# EAGLE design 1s (EAGLE 9.1.1)
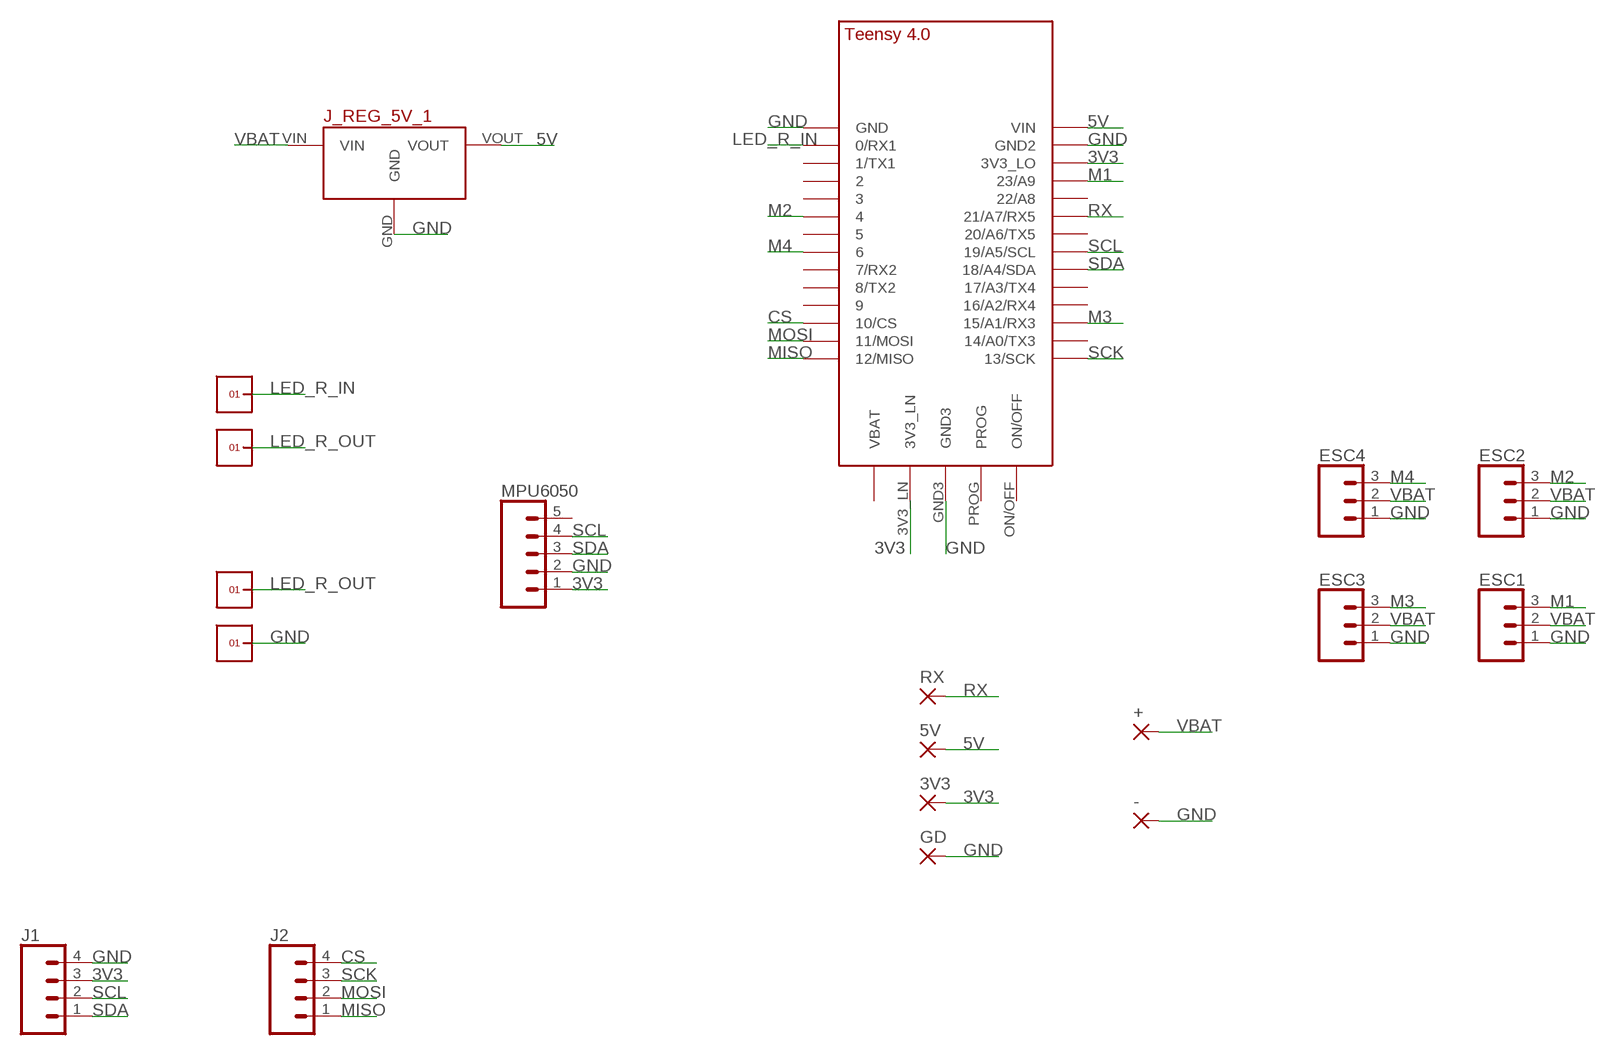
[diagram p0: schematic, sheet 1]

## Parts
3V3  SMD2  [SMD1,27-2,54]
5V  SMD2  [SMD1,27-2,54]
+  SMD5  [SMD2,54-5,08]
-  SMD5  [SMD2,54-5,08]
ESC1  455-1750-1-ND  CONN_03  [1X03]
ESC2  455-1750-1-ND  CONN_03  [1X03]
ESC3  455-1750-1-ND  CONN_03  [1X03]
ESC4  455-1750-1-ND  CONN_03  [1X03]
GD  SMD2  [SMD1,27-2,54]
J1  CONN_041X04_NO_SILK  [1X04_NO_SILK]
J2  CONN_041X04_NO_SILK  [1X04_NO_SILK]
J_REG_5V_1  5V_VOLTAGE_REGULATOR  [5V_VOLTAGE_REGULATOR]
MPU6050  CONN_05NO_SILK  [1X05_NO_SILK]
RX  SMD2  [SMD1,27-2,54]
U$1  TEENSY_4.0  [TEENSY_4.0]
U$3  1X1  [1X1]
U$4  1X1  [1X1]
U$6  1X1  [1X1]
U$7  1X1  [1X1]

## Nets
3V3: 3V3.1(P) J1.3 MPU6050.1 U$1.3V3_LN U$1.3V3_LO
5V: 5V.1(P) J_REG_5V_1.VOUT U$1.VIN
CS: J2.4 U$1.10/CS
GND: -.1(P) ESC1.1 ESC2.1 ESC3.1 ESC4.1 GD.1(P) J1.4 J_REG_5V_1.GND MPU6050.2 U$1.GND U$1.GND2 U$1.GND3 U$7.1
LED_R_IN: U$1.0/RX(0/RX1) U$3.1
LED_R_OUT: U$4.1 U$6.1
M1: ESC1.3 U$1.23/A9
M2: ESC2.3 U$1.4/CANRX
M3: ESC3.3 U$1.15/A1(15/A1/RX3)
M4: ESC4.3 U$1.6
MISO: J2.1 U$1.12/MISO
MOSI: J2.2 U$1.11/MOSI
RX: RX.1(P) U$1.21/A7(21/A7/RX5)
SCK: J2.3 U$1.13/SCK
SCL: J1.2 MPU6050.4 U$1.19/A5/SCL
SDA: J1.1 MPU6050.3 U$1.18/A4/SDA
VBAT: +.1(P) ESC1.2 ESC2.2 ESC3.2 ESC4.2 J_REG_5V_1.VIN
Unconnected: MPU6050.5 U$1.1/TX(1/TX1) U$1.2 U$1.3/CANTX U$1.5 U$1.7(7/RX2) U$1.8(8/TX2) U$1.9/CS U$1.14/A0(14/A0/TX3) U$1.16/A2(16/A2/RX4) U$1.17/A3(17/A3/TX4) U$1.20/A6(20/A6/TX5) U$1.22/A8 U$1.ON/OFF U$1.PROG U$1.VBAT\(VBAT)

## Library data of the parts
3V3 5V GD RX = wirepad:SMD2: SMD PAD
+ - = wirepad:SMD5: SMD PAD
ESC1-ESC4 = SparkFun-Connectors:CONN_03: Multi connection point. Often used as Generic Header-pin footprint for 0.1 inch spaced/style header connections On any of the 0.1 inch spaced packages, you can populate with these: Break Away Headers - Straight <https://www.sparkfun.com/products/116> (PRT-00116) Break Away Male Headers - Right Angle <https://www.sparkfun.com/products/553> (PRT-00553) Female Headers <https://www.sparkfun.com/products/115> (PRT-00115) Break Away Headers - Machine Pin <https://www.sparkfun.com/products/117> (PRT-00117) Break Away Female Headers - Swiss Machine Pin <https://www.sparkfun.com/products/743> (PRT-00743) Stackable Header - 3 Pin (Female, 0.1") <https://www.sparkfun.com/products/13875> (PRT-13875) For SCREWTERMINALS and SPRING TERMINALS visit here: Screw Terimnals on SparkFun.com <https://www.sparkfun.com/search/results?term=Screw+Terminals> (5mm/3.5mm/2.54mm spacing) This device is also useful as a general connection point to wire up your design to another part of your project. Our various solder wires solder well into these plated through hole pads. Hook-Up Wire - Assortment (Stranded, 22 AWG) <https://www.sparkfun.com/products/11375> (PRT-11375) Hook-Up Wire - Assortment (Solid Core, 22 AWG) <https://www.sparkfun.com/products/11367> (PRT-11367) View the entire wire category on our website here <https://www.sparkfun.com/categories/141> Special notes: Molex polarized connector foot print use with SKU : PRT-08232 with associated crimp pins and housings.; PROD_ID: XXX-00000
J1 J2 = SparkFun-Connectors:CONN_04: Multi connection point. Often used as Generic Header-pin footprint for 0.1 inch spaced/style header connections On any of the 0.1 inch spaced packages, you can populate with these: Break Away Headers - Straight <https://www.sparkfun.com/products/116> (PRT-00116) Break Away Male Headers - Right Angle <https://www.sparkfun.com/products/553> (PRT-00553) Female Headers <https://www.sparkfun.com/products/115> (PRT-00115) Break Away Headers - Machine Pin <https://www.sparkfun.com/products/117> (PRT-00117) Break Away Female Headers - Swiss Machine Pin <https://www.sparkfun.com/products/743> (PRT-00743) For SCREWTERMINALS and SPRING TERMINALS visit here: Screw Terimnals on SparkFun.com <https://www.sparkfun.com/search/results?term=Screw+Terminals> (5mm/3.5mm/2.54mm spacing) This device is also useful as a general connection point to wire up your design to another part of your project. Our various solder wires solder well into these plated through hole pads. Hook-Up Wire - Assortment (Stranded, 22 AWG) <https://www.sparkfun.com/products/11375> (PRT-11375) Hook-Up Wire - Assortment (Solid Core, 22 AWG) <https://www.sparkfun.com/products/11367> (PRT-11367) View the entire wire category on our website here <https://www.sparkfun.com/categories/141> Special notes: Molex polarized connector foot print use with SKU : PRT-08231 with associated crimp pins and housings. 1MM SMD Version SKU: PRT-10208; PROD_ID: CONN-09696
J_REG_5V_1 = Pololu Voltage Regulators:5V_VOLTAGE_REGULATOR: Polulu 5V Step-Up/Step-Down Voltage REgulator S7V7F5
MPU6050 = SparkFun-Connectors:CONN_05: Multi connection point. Often used as Generic Header-pin footprint for 0.1 inch spaced/style header connections On any of the 0.1 inch spaced packages, you can populate with these: Break Away Headers - Straight <https://www.sparkfun.com/products/116> (PRT-00116) Break Away Male Headers - Right Angle <https://www.sparkfun.com/products/553> (PRT-00553) Female Headers <https://www.sparkfun.com/products/115> (PRT-00115) Break Away Headers - Machine Pin <https://www.sparkfun.com/products/117> (PRT-00117) Break Away Female Headers - Swiss Machine Pin <https://www.sparkfun.com/products/743> (PRT-00743) For SCREWTERMINALS and SPRING TERMINALS visit here: Screw Terimnals on SparkFun.com <https://www.sparkfun.com/search/results?term=Screw+Terminals> (5mm/3.5mm/2.54mm spacing) This device is also useful as a general connection point to wire up your design to another part of your project. Our various solder wires solder well into these plated through hole pads. Hook-Up Wire - Assortment (Stranded, 22 AWG) <https://www.sparkfun.com/products/11375> (PRT-11375) Hook-Up Wire - Assortment (Solid Core, 22 AWG) <https://www.sparkfun.com/products/11367> (PRT-11367) View the entire wire category on our website here <https://www.sparkfun.com/categories/141> Special notes: Molex polarized connector foot print use with SKU : PRT-08231 with associated crimp pins and housings. 1MM SMD Version SKU: PRT-10208
U$1 = TEENSY 4.0:TEENSY_4.0
U$3 U$4 U$6 U$7 = headers(2mm):1X1

## Board
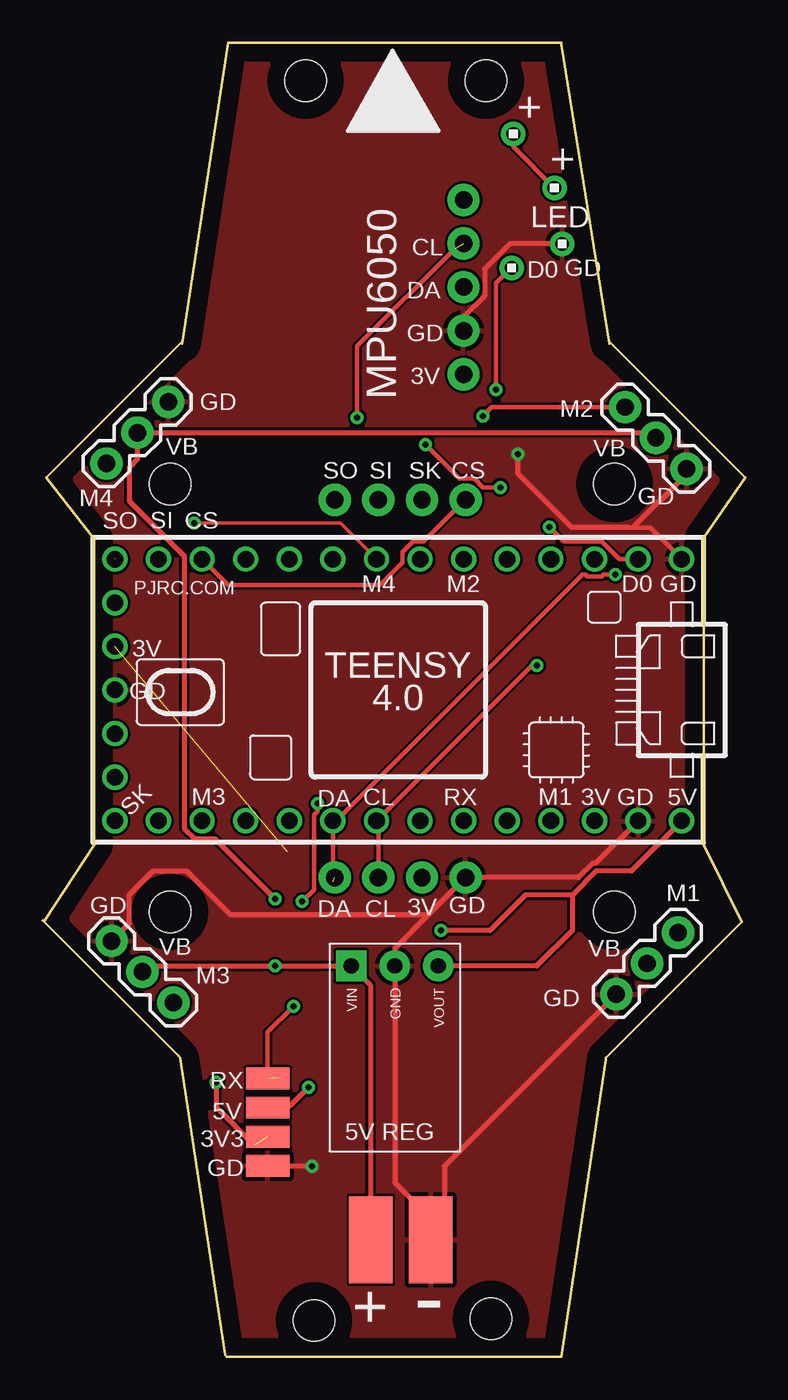
[diagram p1: board, top side]
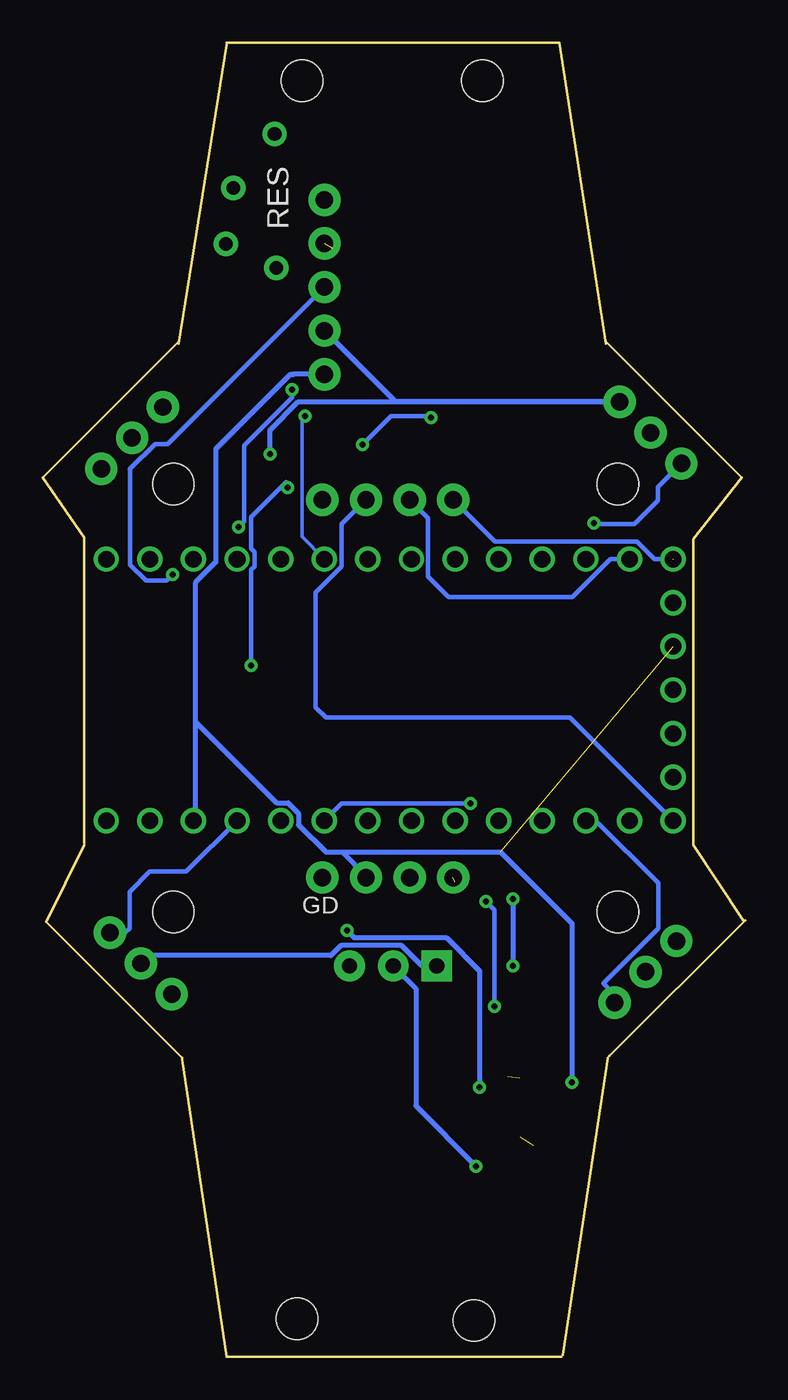
[diagram p2: board, bottom side, seen from below]

Size 40.9 x 76.5 mm. Coordinates in mm from the lower left corner, seen from the top.
Outline: 38.5,47.6 38.5,29.9
Outline: 30.2,76.5 10.8,76.5 8.1,59
Outline: 10.7,0 30.1,0
Outline: 8,17.4 10.6,0.1
Outline: 32.8,17.3 30.2,0
Outline: 32.8,17.4 40.7,25.3 38.5,29.8
Outline: 0.1,25.4 3,29.8 3,47.6 0.2,51.2 8.1,59.1
Outline: 7.9,17.5 0,25.4
Outline: 33,59.1 40.9,51.2 38.5,47.7
Outline: 30.2,76.4 33,59
Copper layers (1*16): Top 0.035mm / dielectric 1.5mm / Bottom 0.035mm
Design rules "default": minimum track width 6mil, minimum drill 0.35mm, track to track 6mil, track to pad 6mil, pad to pad 6mil, via to via 6mil, smd to smd 6mil, copper to edge 40mil, drill to drill 6mil, minimum pad ring 10mil, minimum via ring 8mil, stop-mask expansion 4mil, vias tented up to drill 0mil, thermal gap 10mil
Holes 2.4 mm at 15.3,74.3 25.8,74.3 15.8,2.1 26.1,2.2 33.3,50.8 7.4,50.8 7.4,25.9 33.3,25.9

### Footprints (pad centres in the part's own frame; a part is rotated, then mirrored left to right if it is on the bottom)
SMD1,27-2,54 = smd 1.27 x 2.54: 1 0,0
SMD2,54-5,08 = smd 2.54 x 5.08: 1 0,0
1X03 = drill 1.016 pad 1.88: 1 0,0; 2 2.54,0; 3 5.08,0
1X04_NO_SILK = drill 1.016 pad 1.88: 1 0,0; 2 2.54,0; 3 5.08,0; 4 7.62,0
5V_VOLTAGE_REGULATOR = drill 0.9 pad 1.778: GND 0,-6.35; VOUT -2.54,-6.35 | drill 0.9 pad 1.778 square: VIN 2.54,-6.35
1X05_NO_SILK = drill 1.016 pad 1.88: 1 0,0; 2 2.54,0; 3 5.08,0; 4 7.62,0; 5 10.16,0
TEENSY_4.0 = drill 0.965: 0/RX -13.97,-7.62; 1/TX -11.43,-7.62; 2 -8.89,-7.62; 3/CANTX -6.35,-7.62; 3V3_LN 16.51,-2.54; 3V3_LO -11.43,7.62; 4/CANRX -3.81,-7.62; 5 -1.27,-7.62; 6 1.27,-7.62; 7 3.81,-7.62; 8 6.35,-7.62; 9/CS 8.89,-7.62; 10/CS 11.43,-7.62; 11/MOSI 13.97,-7.62; 12/MISO 16.51,-7.62; 13/SCK 16.51,7.62; 14/A0 13.97,7.62; 15/A1 11.43,7.62; 16/A2 8.89,7.62; 17/A3 6.35,7.62; 18/A4/SDA 3.81,7.62; 19/A5/SCL 1.27,7.62; 20/A6 -1.27,7.62; 21/A7 -3.81,7.62; 22/A8 -6.35,7.62; 23/A9 -8.89,7.62; GND -16.51,-7.62; GND2 -13.97,7.62; GND3 16.51,0; ON/OFF 16.51,5.08; PROG 16.51,2.54; VBAT\ 16.51,-5.08; VIN -16.51,7.62
1X1 = drill 0.8 pad 1.422: 1 0,0

### Placement (x,y rotation side)
3V3  13.1,12.8 90 top
5V  13.1,14.5 90 top
+  19.11,6.8 0 top
-  22.6,6.8 0 top
ESC1  33.4,21.1 45 top
ESC2  37.5,51.7 135 top
ESC3  4,24.2 315 top
ESC4  7.3,55.6 225 top
GD  13.1,11.1 90 top
J1  17,27.9 0 top
J2  17,49.9 0 top
J_REG_5V_1  20.5,16.4 180 top
MPU6050  24.5,57.2 90 top
RX  13.1,16.2 90 top
U$1  20.7,38.82 180 top
U$3  27.3,63.4 0 top
U$4  27.4,71.19 0 top
U$6  29.8,68.05 0 top
U$7  30.25,64.8 0 top

### Tracks (layer width: path | path; a pad name or v marks a point on that pad's centre or on a via)
3V3  (via drill 0.35)  (2 unrouted)
  Top 0.305: v10.08,15.97 10.08,14.55 12.31,12.31
  Bottom 0.305: U$1.3V3_LO 32.03,31.1 32.03,36.99 | v10.08,15.97 10.08,25.21 14.25,29.38 23.49,29.38 | J1.3 22.08,27.97 23.49,29.38 | MPU6050.1 26.33,57.2 26.35,57.17 26.52,57.17 30.83,52.86 30.83,46.27 32.03,45.07 32.03,37.6 32.03,36.99 | 32.03,36.99 27.28,32.24 26.62,32.24 26.01,31.63 26.01,30.97 24.42,29.38 23.49,29.38
5V  (via drill 0.35)
  Top 0.305: 13.2,14.6 13.19,14.59 | 13.19,14.59 5V.1 | J_REG_5V_1.VOUT 28.76,22.75 30.83,24.82 30.83,26.88 | 30.83,26.88 32.22,28.27 34.28,28.27 U$1.VIN | 30.83,26.88 28.1,26.88 26.03,24.81 v23.19,24.81 | v15.46,15.66 14.39,14.59 13.19,14.59
  Bottom 0.305: v23.19,24.81 22.78,24.4 17.4,24.4 15.46,22.46 v15.46,15.66
CS
  Top 0.254: J2.4 22.18,47.46 21.55,47.46 20.95,46.86 20.95,46.23 19.65,44.92 10.79,44.92 U$1.10/CS
GND  (via drill 0.35)
  Top 0.254: U$1.GND 35.37,48.28 34.38,48.28 34.08,48.28
  Top 0.305: 12.46,11.1 GD.1 v15.67,11.09 | 23.08,7.54 20.5,10.12 J_REG_5V_1.GND 20.5,23.78 22.46,25.74 | 22.46,25.74 J1.4 31.2,27.9 32.03,28.73 32.2,28.73 U$1.GND2 | ESC1.1 23.39,11.09 23.39,8.04 | ESC3.1 5.03,25.23 5.03,26.88 6.42,28.27 8.38,28.27 10.91,25.74 22.46,25.74 | 34.38,48.28 37.5,51.4 ESC2.1 | 34.08,48.28 30.81,48.28 27.66,51.43 v27.66,52.55 | v27.66,52.55 27.66,52.65 v27.66,52.55 | 24.5,60.45 24.5,59.8 | 24.5,59.8 MPU6050.2 | U$7.1 27.2,64.8 25.74,63.34 25.74,61.76 24.5,60.52 24.5,59.8
  Bottom 0.305: v15.67,11.09 19.18,14.6 19.18,21.43 J_REG_5V_1.GND | v27.66,52.55 27.66,53.97 26.02,55.6 ESC4.1 20.36,55.6 MPU6050.2
  pour Top: 54.25,80.16 54.25,-1.35 -14.2,-1.35 -14.2,80.16
LED_R_IN  (via drill 0.35)
  Top 0.254: U$1.0/RX 33.57,46.44 32.55,47.46 30.34,47.46 v29.5,48.3 | v26.4,56.3 26.4,62.5 U$3.1
  Bottom 0.254: v29.5,48.3 29.18,48.62 29.18,53.05 26.4,55.83 v26.4,56.3
LED_R_OUT
  Top 0.254: U$4.1 27.41,70.45 U$6.1
M1
  Bottom 0.254: ESC1.3 36.1,24.69 35.84,24.95 35.84,27.07 34.67,28.24 32.55,28.24 U$1.23/A9
M2  (via drill 0.35)
  Top 0.254: ESC2.3 26.14,55.29 v25.62,54.78
  Bottom 0.203: U$1.4/CANRX 25.81,47.74 25.81,54.59 v25.62,54.78
M3
  Bottom 0.254: ESC3.3 7.59,21.08 8.25,21.74 5.06,24.93 5.06,27.58 8.68,31.2 U$1.15/A1
M4  (via drill 0.35)
  Top 0.203: U$1.6 17.33,48.54 v8.8,48.54
  Bottom 0.203: v8.8,48.54 8.41,48.54 8.36,48.48
  Bottom 0.254: 8.36,48.48 6.44,48.48 5.08,49.84 5.08,50.63 ESC4.3
MISO  (1 unrouted)
  Bottom 0.254: J2.1 14.56,47.46 6.31,47.46 5.29,46.44 4.22,46.44
MOSI
  Bottom 0.254: J2.2 18.47,48.83 18.47,45.42 17.27,44.22 10.05,44.22 7.83,46.44 U$1.11/MOSI
RX  (via drill 0.35)  (1 unrouted)
  Top 0.254: 13.9,16.2 13.8,16.3 | v16,32.2 16,31.75 15.78,31.53 15.78,27.18 v15.1,26.5 | v14.6,20.4 13.1,18.9 RX.1
  Bottom 0.254: v16,32.2 16.45,32.2 16.47,32.22 23.49,32.22 U$1.21/A7 | v15.1,26.5 14.6,26 v14.6,20.4
SCK
  Bottom 0.254: U$1.13/SCK 10.19,37.2 24.41,37.2 25.01,37.81 25.01,44.5 23.49,46.02 23.49,48.49 J2.3
SCL  (via drill 0.35)  (1 unrouted)
  Top 0.254: J1.2 19.54,31.09 U$1.19/A5/SCL 28.48,40.25 v28.77,40.25 | v26.64,50.61 25.63,50.61 25.12,51.12 24.27,51.12 v22.27,53.12 | v18.31,54.68 18.31,58.84 24,64.53
  Bottom 0.254: v28.77,40.25 28.77,45.82 28.57,46.02 28.57,46.86 28.77,47.06 28.77,48.89 26.74,50.92 26.64,50.82 v26.64,50.61 | v22.27,53.12 20.61,54.78 18.31,54.78 v18.31,54.68
SDA  (via drill 0.35)  (1 unrouted)
  Top 0.254: U$1.18/A4/SDA 16.89,31.01 | 16.89,31.01 16.89,27.65 17.19,27.35 | 16.89,31.01 31.42,45.53 31.6,45.53 31.71,45.42 32.55,45.42 32.66,45.53 v33.35,45.53
  Bottom 0.254: 35.81,51.71 34.37,53.14 33.64,53.14 MPU6050.3 | 35.81,51.71 35.84,51.67 | 35.81,51.71 35.81,46.11 34.9,45.2 33.68,45.2 v33.35,45.53
VBAT  (via drill 0.35)
  Top 0.305: ESC3.2 6.14,22.75 v13.53,22.75 J_REG_5V_1.VIN 19.08,21.63 19.08,8.05 19.11,8.02 +.1 | v13.53,26.64 10.01,30.16 8.84,30.16 8.23,30.77 8.23,46.62 5.03,49.82 5.03,51.78 5.5,52.25 ESC4.2 35.4,53.8 ESC2.2
  Bottom 0.305: J_REG_5V_1.VIN 18.81,22.75 20.01,23.94 23.53,23.94 24.12,23.36 34.73,23.36 ESC1.2 | v13.53,26.64 v13.53,22.75

### Text on the board
tNames: + | + | MPU6050 | LED | CL | D0 | GD | DA | GD | 3V | GD | M2 | VB | VB | SO | SI | SK | CS | M4 | GD | SO | SI | CS | M4 | M2 | D0 | GD | 3V | GD | DA | CL | RX | 3V | GD | 5V | M3 | M1 | SK | GD | DA | CL | 3V | GD | M1 | VB | VB | M3 | GD | + | -
bNames: RES | GD